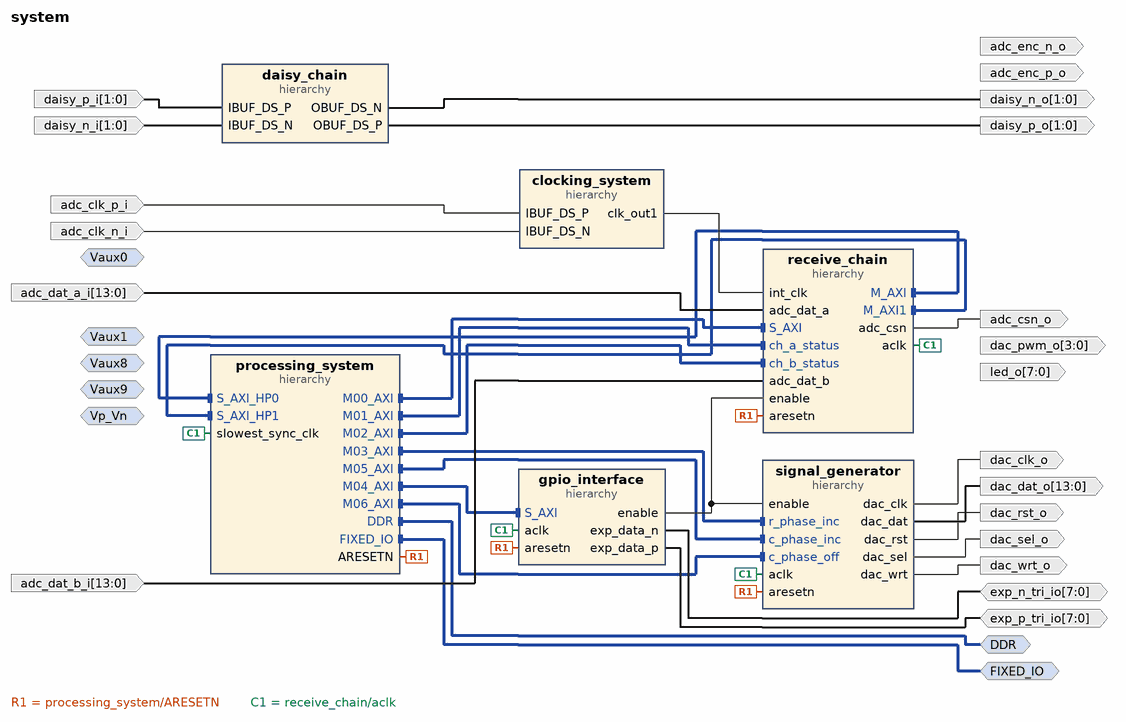
[diagram p0: block diagram of the top level]
# Vivado block design system, Vivado 2016.2
create_bd_design system

create_bd_intf_port -mode Master -vlnv xilinx.com:interface:ddrx_rtl:1.0 DDR
create_bd_intf_port -mode Master -vlnv xilinx.com:display_processing_system7:fixedio_rtl:1.0 FIXED_IO
create_bd_intf_port -mode Slave -vlnv xilinx.com:interface:diff_analog_io_rtl:1.0 Vp_Vn
create_bd_intf_port -mode Slave -vlnv xilinx.com:interface:diff_analog_io_rtl:1.0 Vaux0
create_bd_intf_port -mode Slave -vlnv xilinx.com:interface:diff_analog_io_rtl:1.0 Vaux1
create_bd_intf_port -mode Slave -vlnv xilinx.com:interface:diff_analog_io_rtl:1.0 Vaux9
create_bd_intf_port -mode Slave -vlnv xilinx.com:interface:diff_analog_io_rtl:1.0 Vaux8
create_bd_port -dir O adc_enc_p_o
create_bd_port -dir O adc_enc_n_o
create_bd_port -dir O -from 3 -to 0 dac_pwm_o
create_bd_port -dir O -from 7 -to 0 led_o
create_bd_port -dir I -from 13 -to 0 adc_dat_a_i
create_bd_port -dir I -from 13 -to 0 adc_dat_b_i
create_bd_port -dir O adc_csn_o
create_bd_port -dir O -from 1 -to 0 daisy_n_o
create_bd_port -dir O -from 1 -to 0 daisy_p_o
create_bd_port -dir I -from 1 -to 0 daisy_p_i
create_bd_port -dir I -from 1 -to 0 daisy_n_i
create_bd_port -dir I adc_clk_p_i
create_bd_port -dir I adc_clk_n_i
create_bd_port -dir O dac_clk_o
create_bd_port -dir O dac_rst_o
create_bd_port -dir O dac_sel_o
create_bd_port -dir O dac_wrt_o
create_bd_port -dir O -from 13 -to 0 dac_dat_o
create_bd_port -dir IO -from 7 -to 0 exp_n_tri_io
create_bd_port -dir IO -from 7 -to 0 exp_p_tri_io

create_bd_cell -type hier daisy_chain
create_bd_cell -type hier clocking_system
create_bd_cell -type hier processing_system
create_bd_cell -type hier receive_chain
create_bd_cell -type hier signal_generator
create_bd_cell -type hier gpio_interface

# ---- hierarchy /daisy_chain ----
current_bd_instance /daisy_chain
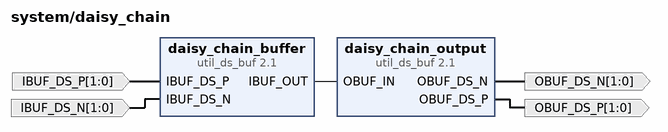
[diagram p1: block diagram inside /daisy_chain]
create_bd_pin -dir I -from 1 -to 0 IBUF_DS_P
create_bd_pin -dir I -from 1 -to 0 IBUF_DS_N
create_bd_pin -dir O -from 1 -to 0 OBUF_DS_P
create_bd_pin -dir O -from 1 -to 0 OBUF_DS_N

create_bd_cell -type ip -vlnv xilinx.com:ip:util_ds_buf:2.1 daisy_chain_buffer
set_property -dict {CONFIG.C_SIZE 2} [get_bd_cells daisy_chain_buffer]
create_bd_cell -type ip -vlnv xilinx.com:ip:util_ds_buf:2.1 daisy_chain_output
set_property -dict {CONFIG.C_SIZE 2 CONFIG.C_BUF_TYPE OBUFDS} [get_bd_cells daisy_chain_output]

# ---- hierarchy /clocking_system ----
current_bd_instance /clocking_system
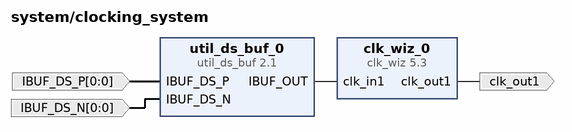
[diagram p2: block diagram inside /clocking_system]
create_bd_pin -dir I -from 0 -to 0 IBUF_DS_P
create_bd_pin -dir I -from 0 -to 0 IBUF_DS_N
create_bd_pin -dir O -type clk clk_out1

create_bd_cell -type ip -vlnv xilinx.com:ip:util_ds_buf:2.1 util_ds_buf_0
create_bd_cell -type ip -vlnv xilinx.com:ip:clk_wiz:5.3 clk_wiz_0
set_property -dict [list \
  CONFIG.PRIM_IN_FREQ 125 \
  CONFIG.CLKIN1_JITTER_PS 80.0 \
  CONFIG.CLKOUT1_REQUESTED_OUT_FREQ 125 \
  CONFIG.USE_LOCKED false \
  CONFIG.USE_RESET false \
  CONFIG.MMCM_DIVCLK_DIVIDE 1 \
  CONFIG.MMCM_CLKFBOUT_MULT_F 8.000 \
  CONFIG.MMCM_CLKIN1_PERIOD 8.0 \
  CONFIG.MMCM_CLKOUT0_DIVIDE_F 8.000 \
  CONFIG.CLKOUT1_JITTER 119.348 \
  CONFIG.CLKOUT1_PHASE_ERROR 96.948 \
] [get_bd_cells clk_wiz_0]

# ---- hierarchy /processing_system ----
current_bd_instance /processing_system
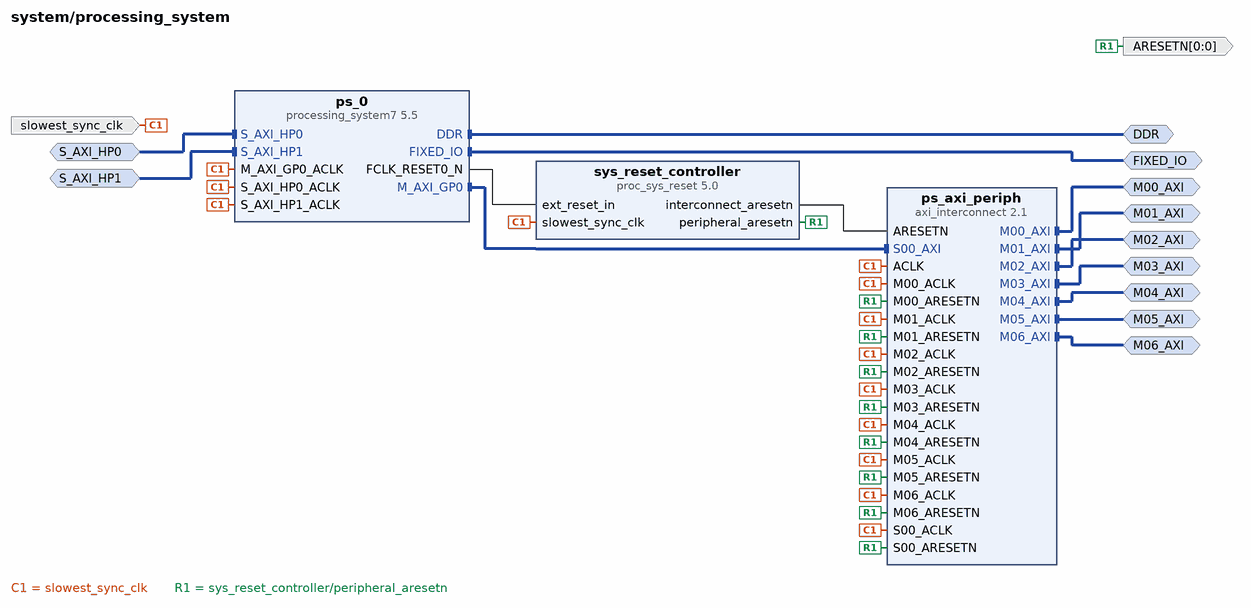
[diagram p3: block diagram inside /processing_system]
create_bd_intf_pin -mode Master -vlnv xilinx.com:interface:ddrx_rtl:1.0 DDR
create_bd_intf_pin -mode Master -vlnv xilinx.com:display_processing_system7:fixedio_rtl:1.0 FIXED_IO
create_bd_intf_pin -mode Slave -vlnv xilinx.com:interface:aximm_rtl:1.0 S_AXI_HP0
create_bd_intf_pin -mode Slave -vlnv xilinx.com:interface:aximm_rtl:1.0 S_AXI_HP1
create_bd_intf_pin -mode Master -vlnv xilinx.com:interface:aximm_rtl:1.0 M00_AXI
create_bd_intf_pin -mode Master -vlnv xilinx.com:interface:aximm_rtl:1.0 M01_AXI
create_bd_intf_pin -mode Master -vlnv xilinx.com:interface:aximm_rtl:1.0 M02_AXI
create_bd_intf_pin -mode Master -vlnv xilinx.com:interface:aximm_rtl:1.0 M03_AXI
create_bd_intf_pin -mode Master -vlnv xilinx.com:interface:aximm_rtl:1.0 M04_AXI
create_bd_intf_pin -mode Master -vlnv xilinx.com:interface:aximm_rtl:1.0 M05_AXI
create_bd_intf_pin -mode Master -vlnv xilinx.com:interface:aximm_rtl:1.0 M06_AXI
create_bd_pin -dir I -type clk slowest_sync_clk
create_bd_pin -dir O -from 0 -to 0 -type rst ARESETN

create_bd_cell -type ip -vlnv xilinx.com:ip:processing_system7:5.5 ps_0
set_property -dict [list \
  CONFIG.PCW_FPGA0_PERIPHERAL_FREQMHZ 155 \
  CONFIG.PCW_USE_S_AXI_HP0 1 \
  CONFIG.PCW_USE_S_AXI_HP1 1 \
  CONFIG.PCW_S_AXI_HP0_DATA_WIDTH 32 \
  CONFIG.PCW_S_AXI_HP1_DATA_WIDTH 32 \
  CONFIG.PCW_EN_CLK0_PORT 0 \
  CONFIG.PCW_IMPORT_BOARD_PRESET cfg/red_pitaya.xml \
  CONFIG.PCW_QSPI_GRP_SINGLE_SS_ENABLE 1 \
] [get_bd_cells ps_0]
# 3 more settings of ps_0 are not shown: defaults, MIO pin electricals, DDR timing, and values the tool derives
create_bd_cell -type ip -vlnv xilinx.com:ip:proc_sys_reset:5.0 sys_reset_controller
create_bd_cell -type ip -vlnv xilinx.com:ip:axi_interconnect:2.1 ps_axi_periph
set_property -dict {CONFIG.NUM_MI 7 CONFIG.ENABLE_ADVANCED_OPTIONS 0} [get_bd_cells ps_axi_periph]

# ---- hierarchy /receive_chain ----
current_bd_instance /receive_chain
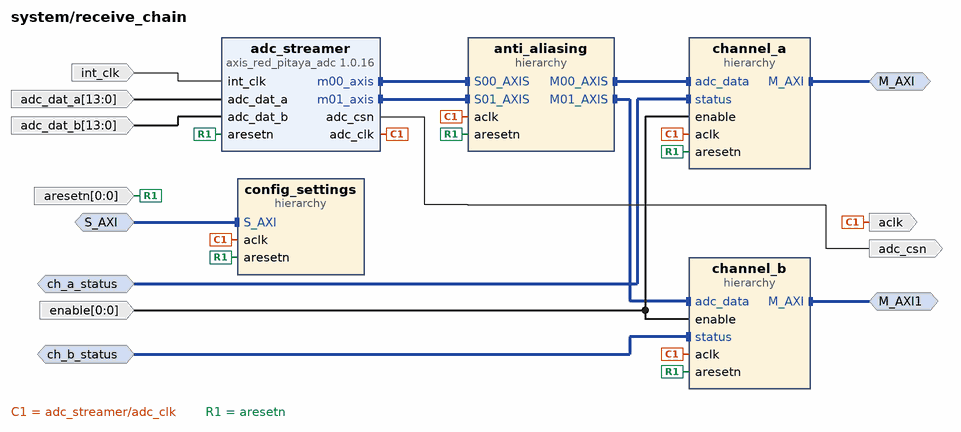
[diagram p4: block diagram inside /receive_chain]
create_bd_intf_pin -mode Slave -vlnv xilinx.com:interface:aximm_rtl:1.0 ch_a_status
create_bd_intf_pin -mode Master -vlnv xilinx.com:interface:aximm_rtl:1.0 M_AXI
create_bd_intf_pin -mode Master -vlnv xilinx.com:interface:aximm_rtl:1.0 M_AXI1
create_bd_intf_pin -mode Slave -vlnv xilinx.com:interface:aximm_rtl:1.0 ch_b_status
create_bd_intf_pin -mode Slave -vlnv xilinx.com:interface:aximm_rtl:1.0 S_AXI
create_bd_pin -dir O -type clk aclk
create_bd_pin -dir O adc_csn
create_bd_pin -dir I int_clk
create_bd_pin -dir I -from 13 -to 0 adc_dat_a
create_bd_pin -dir I -from 13 -to 0 adc_dat_b
create_bd_pin -dir I -from 0 -to 0 -type rst aresetn
create_bd_pin -dir I -from 0 -to 0 -type rst enable

create_bd_cell -type ip -vlnv pavel-demin:user:axis_red_pitaya_adc:1.0.16 adc_streamer
set_property -dict {CONFIG.AXIS_TDATA_WIDTH 16} [get_bd_cells adc_streamer]
create_bd_cell -type hier channel_a
create_bd_cell -type hier channel_b
create_bd_cell -type hier config_settings
create_bd_cell -type hier anti_aliasing

# ---- hierarchy /receive_chain/channel_a ----
current_bd_instance /receive_chain/channel_a
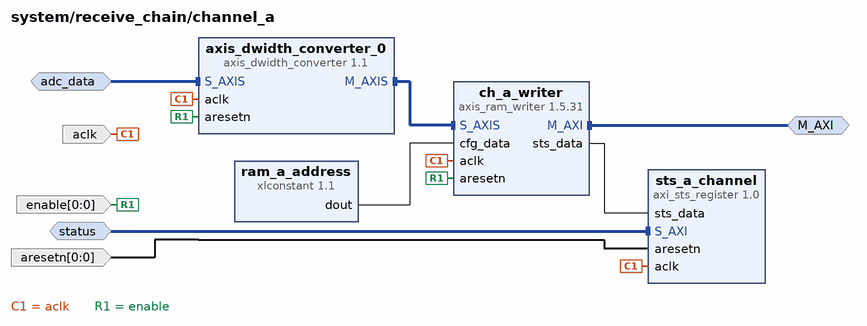
[diagram p5: block diagram inside /receive_chain/channel_a]
create_bd_intf_pin -mode Slave -vlnv xilinx.com:interface:aximm_rtl:1.0 status
create_bd_intf_pin -mode Master -vlnv xilinx.com:interface:aximm_rtl:1.0 M_AXI
create_bd_intf_pin -mode Slave -vlnv xilinx.com:interface:axis_rtl:1.0 adc_data
create_bd_pin -dir I -type clk aclk
create_bd_pin -dir I -from 0 -to 0 -type rst enable
create_bd_pin -dir I -from 0 -to 0 -type rst aresetn

create_bd_cell -type ip -vlnv xilinx.com:ip:axis_dwidth_converter:1.1 axis_dwidth_converter_0
set_property -dict {CONFIG.S_TDATA_NUM_BYTES 2 CONFIG.M_TDATA_NUM_BYTES 4} [get_bd_cells axis_dwidth_converter_0]
create_bd_cell -type ip -vlnv tighe-barris:user:axis_ram_writer:1.5.31 ch_a_writer
set_property -dict {CONFIG.AXI_DATA_WIDTH 32 CONFIG.AXIS_TDATA_WIDTH 32} [get_bd_cells ch_a_writer]
create_bd_cell -type ip -vlnv xilinx.com:ip:xlconstant:1.1 ram_a_address
set_property -dict {CONFIG.CONST_WIDTH 32 CONFIG.CONST_VAL 503316480} [get_bd_cells ram_a_address]
create_bd_cell -type ip -vlnv pavel-demin:user:axi_sts_register:1.0 sts_a_channel
set_property -dict {CONFIG.STS_DATA_WIDTH 32 CONFIG.AXI_DATA_WIDTH 32 CONFIG.AXI_ADDR_WIDTH 32} [get_bd_cells sts_a_channel]

# ---- hierarchy /receive_chain/channel_b ----
current_bd_instance /receive_chain/channel_b
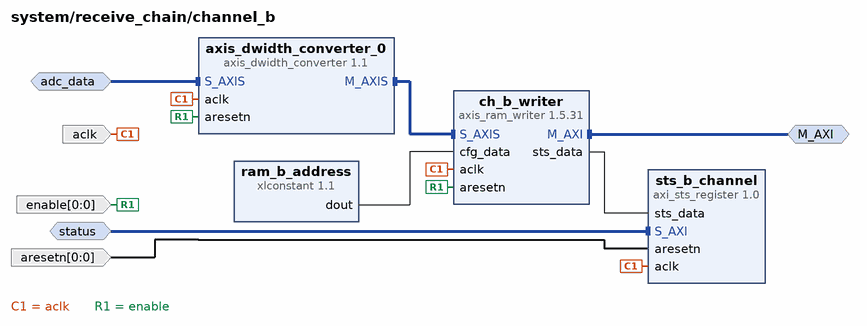
[diagram p6: block diagram inside /receive_chain/channel_b]
create_bd_intf_pin -mode Master -vlnv xilinx.com:interface:aximm_rtl:1.0 M_AXI
create_bd_intf_pin -mode Slave -vlnv xilinx.com:interface:aximm_rtl:1.0 status
create_bd_intf_pin -mode Slave -vlnv xilinx.com:interface:axis_rtl:1.0 adc_data
create_bd_pin -dir I -type clk aclk
create_bd_pin -dir I -from 0 -to 0 -type rst enable
create_bd_pin -dir I -from 0 -to 0 -type rst aresetn

create_bd_cell -type ip -vlnv xilinx.com:ip:axis_dwidth_converter:1.1 axis_dwidth_converter_0
set_property -dict {CONFIG.S_TDATA_NUM_BYTES 2 CONFIG.M_TDATA_NUM_BYTES 4} [get_bd_cells axis_dwidth_converter_0]
create_bd_cell -type ip -vlnv tighe-barris:user:axis_ram_writer:1.5.31 ch_b_writer
set_property -dict {CONFIG.AXI_DATA_WIDTH 32 CONFIG.AXIS_TDATA_WIDTH 32} [get_bd_cells ch_b_writer]
create_bd_cell -type ip -vlnv xilinx.com:ip:xlconstant:1.1 ram_b_address
set_property -dict {CONFIG.CONST_WIDTH 32 CONFIG.CONST_VAL 507510784} [get_bd_cells ram_b_address]
create_bd_cell -type ip -vlnv pavel-demin:user:axi_sts_register:1.0 sts_b_channel
set_property -dict {CONFIG.STS_DATA_WIDTH 32 CONFIG.AXI_DATA_WIDTH 32 CONFIG.AXI_ADDR_WIDTH 32} [get_bd_cells sts_b_channel]

# ---- hierarchy /receive_chain/config_settings ----
current_bd_instance /receive_chain/config_settings
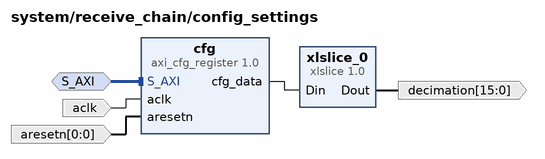
[diagram p7: block diagram inside /receive_chain/config_settings]
create_bd_intf_pin -mode Slave -vlnv xilinx.com:interface:aximm_rtl:1.0 S_AXI
create_bd_pin -dir O -from 15 -to 0 decimation
create_bd_pin -dir I -type clk aclk
create_bd_pin -dir I -from 0 -to 0 -type rst aresetn

create_bd_cell -type ip -vlnv xilinx.com:ip:xlslice:1.0 xlslice_0
set_property -dict {CONFIG.DOUT_WIDTH 16 CONFIG.DIN_TO 0 CONFIG.DIN_FROM 15} [get_bd_cells xlslice_0]
create_bd_cell -type ip -vlnv pavel-demin:user:axi_cfg_register:1.0 cfg
set_property -dict {CONFIG.CFG_DATA_WIDTH 32 CONFIG.AXI_DATA_WIDTH 32 CONFIG.AXI_ADDR_WIDTH 32} [get_bd_cells cfg]

# ---- hierarchy /receive_chain/anti_aliasing ----
current_bd_instance /receive_chain/anti_aliasing
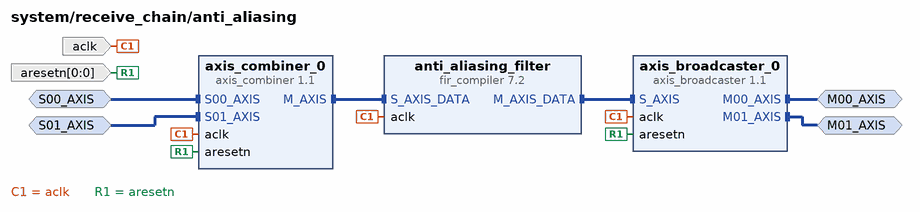
[diagram p8: block diagram inside /receive_chain/anti_aliasing]
create_bd_intf_pin -mode Slave -vlnv xilinx.com:interface:axis_rtl:1.0 S00_AXIS
create_bd_intf_pin -mode Slave -vlnv xilinx.com:interface:axis_rtl:1.0 S01_AXIS
create_bd_intf_pin -mode Master -vlnv xilinx.com:interface:axis_rtl:1.0 M00_AXIS
create_bd_intf_pin -mode Master -vlnv xilinx.com:interface:axis_rtl:1.0 M01_AXIS
create_bd_pin -dir I -type clk aclk
create_bd_pin -dir I -from 0 -to 0 -type rst aresetn

create_bd_cell -type ip -vlnv xilinx.com:ip:fir_compiler:7.2 anti_aliasing_filter
set_property -dict [list \
  CONFIG.CoefficientVector {0.000025654459771250994, 0.000074863433896161, 0.00014308597017204932, 0.00019205063416382977, 0.0001604266530866464, -0.000008361124011312541, -0.00032043167611177034, -0.0006926140921754971, -0.000952723258629777, -0.0008994245783101239, -0.0004099213080782916, 0.00045435909055407036, 0.001412980878301107, 0.0020510013567718688, 0.002010531508597773, 0.0012039571783876246, -0.00007720411271357928, -0.001254337513318309, -0.0017500056617930227, -0.0013406384683297494, -0.000364990726555941, 0.0003826285989469067, 0.00008693721353558415, -0.0015214223511449368, -0.003798614881415195, -0.00531121573513606, -0.004506260726651526, -0.0006549938308313636, 0.005439256657198806, 0.011455971684251895, 0.014456936577037123, 0.012339604921760181, 0.005119097924542997, -0.004725973426464719, -0.013202481140406187, -0.016715219789056705, -0.013998812495713744, -0.006966205975086943, 0.00016574983988531652, 0.0032006059922921235, 0.0005689297840865515, -0.0052985069269039795, -0.008860114692637512, -0.004478366117148616, 0.009848915330440116, 0.03011212731262171, 0.04692240258961073, 0.049390849984873475, 0.030726993425922545, -0.0071576310773233615, -0.052642137519117345, -0.08807787289178556, -0.09698989684947774, -0.07171979224533209, -0.01789182930481286, 0.046697650201782306, 0.09868128702828007, 0.11853265350570316, 0.09868128702828007, 0.046697650201782306, -0.01789182930481286, -0.07171979224533209, -0.09698989684947774, -0.08807787289178556, -0.052642137519117345, -0.0071576310773233615, 0.030726993425922545, 0.049390849984873475, 0.04692240258961073, 0.03011212731262171, 0.009848915330440116, -0.004478366117148616, -0.008860114692637512, -0.0052985069269039795, 0.0005689297840865515, 0.0032006059922921235, 0.00016574983988531652, -0.006966205975086943, -0.013998812495713744, -0.016715219789056705, -0.013202481140406187, -0.004725973426464719, 0.005119097924542997, 0.012339604921760181, 0.014456936577037123, 0.011455971684251895, 0.005439256657198806, -0.0006549938308313636, -0.004506260726651526, -0.00531121573513606, -0.003798614881415195, -0.0015214223511449368, 0.00008693721353558415, 0.0003826285989469067, -0.000364990726555941, -0.0013406384683297494, -0.0017500056617930227, -0.001254337513318309, -0.00007720411271357928, 0.0012039571783876246, 0.002010531508597773, 0.0020510013567718688, 0.001412980878301107, 0.00045435909055407036, -0.0004099213080782916, -0.0008994245783101239, -0.000952723258629777, -0.0006926140921754971, -0.00032043167611177034, -0.000008361124011312541, 0.0001604266530866464, 0.00019205063416382977, 0.00014308597017204932, 0.000074863433896161, 0.000025654459771250994} \
  CONFIG.Coefficient_Sets 1 \
  CONFIG.Filter_Type Decimation \
  CONFIG.Interpolation_Rate 1 \
  CONFIG.Decimation_Rate 8 \
  CONFIG.Zero_Pack_Factor 1 \
  CONFIG.Number_Channels 1 \
  CONFIG.Number_Paths 2 \
  CONFIG.RateSpecification Frequency_Specification \
  CONFIG.Sample_Frequency 125 \
  CONFIG.Clock_Frequency 125 \
  CONFIG.Coefficient_Sign Signed \
  CONFIG.Quantization Quantize_Only \
  CONFIG.Coefficient_Width 32 \
  CONFIG.Coefficient_Fractional_Bits 34 \
  CONFIG.Coefficient_Structure Inferred \
  CONFIG.Data_Width 14 \
  CONFIG.Output_Rounding_Mode Convergent_Rounding_to_Even \
  CONFIG.Output_Width 16 \
  CONFIG.Filter_Architecture Systolic_Multiply_Accumulate \
  CONFIG.ColumnConfig 8 \
] [get_bd_cells anti_aliasing_filter]
create_bd_cell -type ip -vlnv xilinx.com:ip:axis_combiner:1.1 axis_combiner_0
set_property -dict {CONFIG.TDATA_NUM_BYTES 2} [get_bd_cells axis_combiner_0]
create_bd_cell -type ip -vlnv xilinx.com:ip:axis_broadcaster:1.1 axis_broadcaster_0
set_property -dict [list \
  CONFIG.M_TDATA_NUM_BYTES 2 \
  CONFIG.S_TDATA_NUM_BYTES 4 \
  CONFIG.M00_TDATA_REMAP {tdata[15:0]} \
  CONFIG.M01_TDATA_REMAP {tdata[31:16]} \
] [get_bd_cells axis_broadcaster_0]

# ---- hierarchy /signal_generator ----
current_bd_instance /signal_generator
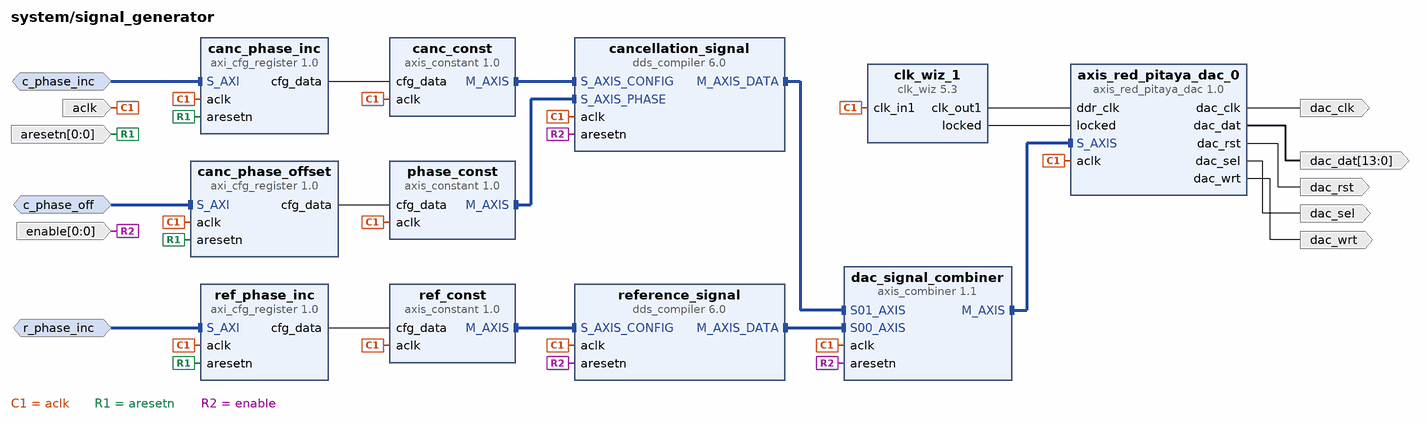
[diagram p9: block diagram inside /signal_generator]
create_bd_intf_pin -mode Slave -vlnv xilinx.com:interface:aximm_rtl:1.0 r_phase_inc
create_bd_intf_pin -mode Slave -vlnv xilinx.com:interface:aximm_rtl:1.0 c_phase_inc
create_bd_intf_pin -mode Slave -vlnv xilinx.com:interface:aximm_rtl:1.0 c_phase_off
create_bd_pin -dir I -type clk aclk
create_bd_pin -dir O -type clk dac_clk
create_bd_pin -dir O -type rst dac_rst
create_bd_pin -dir O dac_sel
create_bd_pin -dir O dac_wrt
create_bd_pin -dir O -from 13 -to 0 dac_dat
create_bd_pin -dir I -from 0 -to 0 -type rst aresetn
create_bd_pin -dir I -from 0 -to 0 -type rst enable

create_bd_cell -type ip -vlnv pavel-demin:user:axis_red_pitaya_dac:1.0 axis_red_pitaya_dac_0
create_bd_cell -type ip -vlnv xilinx.com:ip:clk_wiz:5.3 clk_wiz_1
set_property -dict [list \
  CONFIG.PRIM_IN_FREQ 125 \
  CONFIG.CLKIN1_JITTER_PS 80.0 \
  CONFIG.CLKOUT1_REQUESTED_OUT_FREQ 250 \
  CONFIG.USE_RESET false \
  CONFIG.MMCM_DIVCLK_DIVIDE 1 \
  CONFIG.MMCM_CLKFBOUT_MULT_F 8.000 \
  CONFIG.MMCM_CLKIN1_PERIOD 8.0 \
  CONFIG.MMCM_CLKOUT0_DIVIDE_F 4.000 \
  CONFIG.CLKOUT1_JITTER 104.759 \
  CONFIG.CLKOUT1_PHASE_ERROR 96.948 \
] [get_bd_cells clk_wiz_1]
create_bd_cell -type ip -vlnv xilinx.com:ip:dds_compiler:6.0 reference_signal
set_property -dict [list \
  CONFIG.DDS_Clock_Rate 125 \
  CONFIG.Parameter_Entry Hardware_Parameters \
  CONFIG.Frequency_Resolution 0.4 \
  CONFIG.Noise_Shaping None \
  CONFIG.Phase_Width 32 \
  CONFIG.Output_Width 13 \
  CONFIG.Phase_Increment Programmable \
  CONFIG.Output_Selection Sine \
  CONFIG.Amplitude_Mode Full_Range \
  CONFIG.Has_Phase_Out false \
  CONFIG.DATA_Has_TLAST Not_Required \
  CONFIG.S_PHASE_Has_TUSER Not_Required \
  CONFIG.M_DATA_Has_TUSER Not_Required \
  CONFIG.Latency 7 \
  CONFIG.Has_ARESETn true \
  CONFIG.Output_Frequency1 0 \
  CONFIG.PINC1 10000011000100100110111 \
] [get_bd_cells reference_signal]
create_bd_cell -type ip -vlnv pavel-demin:user:axi_cfg_register:1.0 ref_phase_inc
set_property -dict {CONFIG.CFG_DATA_WIDTH 32 CONFIG.AXI_DATA_WIDTH 32} [get_bd_cells ref_phase_inc]
create_bd_cell -type ip -vlnv pavel-demin:user:axis_constant:1.0 ref_const
set_property -dict {CONFIG.AXIS_TDATA_WIDTH 32} [get_bd_cells ref_const]
create_bd_cell -type ip -vlnv pavel-demin:user:axi_cfg_register:1.0 canc_phase_inc
set_property -dict {CONFIG.CFG_DATA_WIDTH 32} [get_bd_cells canc_phase_inc]
create_bd_cell -type ip -vlnv pavel-demin:user:axis_constant:1.0 canc_const
create_bd_cell -type ip -vlnv xilinx.com:ip:dds_compiler:6.0 cancellation_signal
set_property -dict [list \
  CONFIG.DDS_Clock_Rate 125 \
  CONFIG.Parameter_Entry Hardware_Parameters \
  CONFIG.Frequency_Resolution 0.4 \
  CONFIG.Noise_Shaping None \
  CONFIG.Phase_Width 32 \
  CONFIG.Output_Width 13 \
  CONFIG.Phase_Increment Programmable \
  CONFIG.Phase_offset Streaming \
  CONFIG.Output_Selection Sine \
  CONFIG.Amplitude_Mode Full_Range \
  CONFIG.Has_Phase_Out false \
  CONFIG.DATA_Has_TLAST Not_Required \
  CONFIG.S_PHASE_Has_TUSER Not_Required \
  CONFIG.M_DATA_Has_TUSER Not_Required \
  CONFIG.Latency 8 \
  CONFIG.Has_ARESETn true \
  CONFIG.Output_Frequency1 0 \
  CONFIG.PINC1 10000011000100100110111 \
] [get_bd_cells cancellation_signal]
create_bd_cell -type ip -vlnv xilinx.com:ip:axis_combiner:1.1 dac_signal_combiner
create_bd_cell -type ip -vlnv pavel-demin:user:axis_constant:1.0 phase_const
create_bd_cell -type ip -vlnv pavel-demin:user:axi_cfg_register:1.0 canc_phase_offset
set_property -dict {CONFIG.CFG_DATA_WIDTH 32} [get_bd_cells canc_phase_offset]

# ---- hierarchy /gpio_interface ----
current_bd_instance /gpio_interface
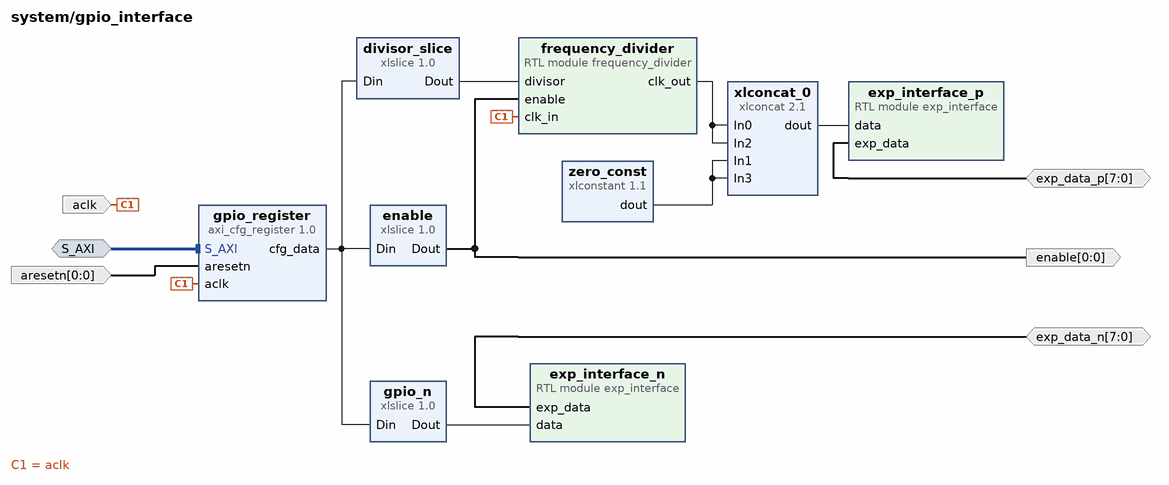
[diagram p10: block diagram inside /gpio_interface]
create_bd_intf_pin -mode Slave -vlnv xilinx.com:interface:aximm_rtl:1.0 S_AXI
create_bd_pin -dir I -type clk aclk
create_bd_pin -dir I -from 0 -to 0 -type rst aresetn
create_bd_pin -dir IO -from 7 -to 0 exp_data_n
create_bd_pin -dir IO -from 7 -to 0 exp_data_p
create_bd_pin -dir O -from 0 -to 0 enable

create_bd_cell -type ip -vlnv pavel-demin:user:axi_cfg_register:1.0 gpio_register
set_property -dict {CONFIG.CFG_DATA_WIDTH 32} [get_bd_cells gpio_register]
create_bd_cell -type ip -vlnv xilinx.com:ip:xlslice:1.0 enable
set_property -dict {CONFIG.DOUT_WIDTH 1 CONFIG.DIN_TO 8 CONFIG.DIN_FROM 8} [get_bd_cells enable]
create_bd_cell -type ip -vlnv xilinx.com:ip:xlslice:1.0 gpio_n
set_property -dict {CONFIG.DOUT_WIDTH 8 CONFIG.DIN_TO 0 CONFIG.DIN_FROM 7} [get_bd_cells gpio_n]
create_bd_cell -type ip -vlnv xilinx.com:ip:xlconcat:2.1 xlconcat_0
set_property -dict [list \
  CONFIG.NUM_PORTS 4 \
  CONFIG.IN0_WIDTH 1 \
  CONFIG.IN1_WIDTH 3 \
  CONFIG.IN2_WIDTH 1 \
  CONFIG.IN3_WIDTH 3 \
] [get_bd_cells xlconcat_0]
create_bd_cell -type module -reference exp_interface exp_interface_n
create_bd_cell -type ip -vlnv xilinx.com:ip:xlslice:1.0 divisor_slice
set_property -dict {CONFIG.DOUT_WIDTH 23 CONFIG.DIN_TO 9 CONFIG.DIN_FROM 31} [get_bd_cells divisor_slice]
create_bd_cell -type ip -vlnv xilinx.com:ip:xlconstant:1.1 zero_const
set_property -dict {CONFIG.CONST_WIDTH 3 CONFIG.CONST_VAL 0} [get_bd_cells zero_const]
create_bd_cell -type module -reference frequency_divider frequency_divider
create_bd_cell -type module -reference exp_interface exp_interface_p

# ---- connections ----

current_bd_instance /daisy_chain
connect_bd_net [get_bd_pins daisy_chain_buffer/IBUF_OUT] [get_bd_pins daisy_chain_output/OBUF_IN]
connect_bd_net -net daisy_p_i_1 [get_bd_pins IBUF_DS_P] [get_bd_pins daisy_chain_buffer/IBUF_DS_P]
connect_bd_net -net daisy_n_i_1 [get_bd_pins IBUF_DS_N] [get_bd_pins daisy_chain_buffer/IBUF_DS_N]
connect_bd_net -net util_ds_buf_2_OBUF_DS_P [get_bd_pins daisy_chain_output/OBUF_DS_P] [get_bd_pins OBUF_DS_P]
connect_bd_net -net util_ds_buf_2_OBUF_DS_N [get_bd_pins daisy_chain_output/OBUF_DS_N] [get_bd_pins OBUF_DS_N]

current_bd_instance /clocking_system
connect_bd_net [get_bd_pins util_ds_buf_0/IBUF_OUT] [get_bd_pins clk_wiz_0/clk_in1]
connect_bd_net -net adc_clk_p_i_1 [get_bd_pins IBUF_DS_P] [get_bd_pins util_ds_buf_0/IBUF_DS_P]
connect_bd_net -net adc_clk_n_i_1 [get_bd_pins IBUF_DS_N] [get_bd_pins util_ds_buf_0/IBUF_DS_N]
connect_bd_net [get_bd_pins clk_wiz_0/clk_out1] [get_bd_pins clk_out1]

current_bd_instance /processing_system
connect_bd_intf_net [get_bd_intf_pins ps_0/M_AXI_GP0] [get_bd_intf_pins ps_axi_periph/S00_AXI]
connect_bd_intf_net [get_bd_intf_pins DDR] [get_bd_intf_pins ps_0/DDR]
connect_bd_intf_net [get_bd_intf_pins FIXED_IO] [get_bd_intf_pins ps_0/FIXED_IO]
connect_bd_intf_net -intf_net axis_ram_writer_0_M_AXI [get_bd_intf_pins S_AXI_HP0] [get_bd_intf_pins ps_0/S_AXI_HP0]
connect_bd_intf_net -intf_net channel_b_M_AXI [get_bd_intf_pins S_AXI_HP1] [get_bd_intf_pins ps_0/S_AXI_HP1]
connect_bd_intf_net [get_bd_intf_pins M00_AXI] [get_bd_intf_pins ps_axi_periph/M00_AXI]
connect_bd_intf_net [get_bd_intf_pins M01_AXI] [get_bd_intf_pins ps_axi_periph/M01_AXI]
connect_bd_intf_net -intf_net S_AXI_1 [get_bd_intf_pins M02_AXI] [get_bd_intf_pins ps_axi_periph/M02_AXI]
connect_bd_intf_net [get_bd_intf_pins M03_AXI] [get_bd_intf_pins ps_axi_periph/M03_AXI]
connect_bd_intf_net [get_bd_intf_pins M04_AXI] [get_bd_intf_pins ps_axi_periph/M04_AXI]
connect_bd_intf_net [get_bd_intf_pins M05_AXI] [get_bd_intf_pins ps_axi_periph/M05_AXI]
connect_bd_intf_net [get_bd_intf_pins M06_AXI] [get_bd_intf_pins ps_axi_periph/M06_AXI]
connect_bd_net [get_bd_pins ps_0/FCLK_RESET0_N] [get_bd_pins sys_reset_controller/ext_reset_in]
connect_bd_net -net rst_0_interconnect_aresetn [get_bd_pins sys_reset_controller/interconnect_aresetn] [get_bd_pins ps_axi_periph/ARESETN]
connect_bd_net -net clk_sync_clk_out1 [get_bd_pins slowest_sync_clk] \
  [get_bd_pins sys_reset_controller/slowest_sync_clk] [get_bd_pins ps_0/S_AXI_HP0_ACLK] [get_bd_pins ps_0/S_AXI_HP1_ACLK] \
  [get_bd_pins ps_0/M_AXI_GP0_ACLK] [get_bd_pins ps_axi_periph/ACLK] [get_bd_pins ps_axi_periph/S00_ACLK] \
  [get_bd_pins ps_axi_periph/M00_ACLK] [get_bd_pins ps_axi_periph/M01_ACLK] [get_bd_pins ps_axi_periph/M02_ACLK] \
  [get_bd_pins ps_axi_periph/M03_ACLK] [get_bd_pins ps_axi_periph/M04_ACLK] [get_bd_pins ps_axi_periph/M05_ACLK] \
  [get_bd_pins ps_axi_periph/M06_ACLK]
connect_bd_net -net xlconstant_0_dout [get_bd_pins sys_reset_controller/peripheral_aresetn] \
  [get_bd_pins ARESETN] [get_bd_pins ps_axi_periph/S00_ARESETN] [get_bd_pins ps_axi_periph/M00_ARESETN] \
  [get_bd_pins ps_axi_periph/M01_ARESETN] [get_bd_pins ps_axi_periph/M02_ARESETN] [get_bd_pins ps_axi_periph/M03_ARESETN] \
  [get_bd_pins ps_axi_periph/M04_ARESETN] [get_bd_pins ps_axi_periph/M05_ARESETN] [get_bd_pins ps_axi_periph/M06_ARESETN]

current_bd_instance /receive_chain
connect_bd_intf_net [get_bd_intf_pins adc_streamer/m00_axis] [get_bd_intf_pins anti_aliasing/S00_AXIS]
connect_bd_intf_net [get_bd_intf_pins adc_streamer/m01_axis] [get_bd_intf_pins anti_aliasing/S01_AXIS]
connect_bd_intf_net -intf_net axis_broadcaster_0_M00_AXIS [get_bd_intf_pins anti_aliasing/M00_AXIS] [get_bd_intf_pins channel_a/adc_data]
connect_bd_intf_net -intf_net axis_broadcaster_0_M01_AXIS [get_bd_intf_pins anti_aliasing/M01_AXIS] [get_bd_intf_pins channel_b/adc_data]
connect_bd_intf_net [get_bd_intf_pins ch_a_status] [get_bd_intf_pins channel_a/status]
connect_bd_intf_net -intf_net axis_ram_writer_0_M_AXI [get_bd_intf_pins M_AXI] [get_bd_intf_pins channel_a/M_AXI]
connect_bd_intf_net [get_bd_intf_pins M_AXI1] [get_bd_intf_pins channel_b/M_AXI]
connect_bd_intf_net -intf_net S_AXI_1 [get_bd_intf_pins ch_b_status] [get_bd_intf_pins channel_b/status]
connect_bd_intf_net [get_bd_intf_pins S_AXI] [get_bd_intf_pins config_settings/S_AXI]
connect_bd_net -net clk_sync_clk_out1 [get_bd_pins adc_streamer/adc_clk] \
  [get_bd_pins aclk] [get_bd_pins channel_b/aclk] [get_bd_pins config_settings/aclk] [get_bd_pins channel_a/aclk] \
  [get_bd_pins anti_aliasing/aclk]
connect_bd_net -net axis_red_pitaya_adc_0_adc_csn [get_bd_pins adc_streamer/adc_csn] [get_bd_pins adc_csn]
connect_bd_net -net clk_wiz_0_clk_out1 [get_bd_pins int_clk] [get_bd_pins adc_streamer/int_clk]
connect_bd_net -net adc_dat_a_i_1 [get_bd_pins adc_dat_a] [get_bd_pins adc_streamer/adc_dat_a]
connect_bd_net -net adc_dat_b_i_1 [get_bd_pins adc_dat_b] [get_bd_pins adc_streamer/adc_dat_b]
connect_bd_net -net aresetn2_1 [get_bd_pins aresetn] \
  [get_bd_pins adc_streamer/aresetn] [get_bd_pins channel_b/aresetn] [get_bd_pins channel_a/aresetn] \
  [get_bd_pins config_settings/aresetn] [get_bd_pins anti_aliasing/aresetn]
connect_bd_net [get_bd_pins enable] [get_bd_pins channel_b/enable] [get_bd_pins channel_a/enable]

current_bd_instance /receive_chain/channel_a
connect_bd_intf_net [get_bd_intf_pins axis_dwidth_converter_0/M_AXIS] [get_bd_intf_pins ch_a_writer/S_AXIS]
connect_bd_intf_net [get_bd_intf_pins status] [get_bd_intf_pins sts_a_channel/S_AXI]
connect_bd_intf_net -intf_net axis_ram_writer_0_M_AXI [get_bd_intf_pins M_AXI] [get_bd_intf_pins ch_a_writer/M_AXI]
connect_bd_intf_net [get_bd_intf_pins adc_data] [get_bd_intf_pins axis_dwidth_converter_0/S_AXIS]
connect_bd_net [get_bd_pins ram_a_address/dout] [get_bd_pins ch_a_writer/cfg_data]
connect_bd_net [get_bd_pins ch_a_writer/sts_data] [get_bd_pins sts_a_channel/sts_data]
connect_bd_net -net clk_sync_clk_out1 [get_bd_pins aclk] \
  [get_bd_pins ch_a_writer/aclk] [get_bd_pins axis_dwidth_converter_0/aclk] [get_bd_pins sts_a_channel/aclk]
connect_bd_net -net aresetn_1 [get_bd_pins enable] [get_bd_pins axis_dwidth_converter_0/aresetn] [get_bd_pins ch_a_writer/aresetn]
connect_bd_net -net aresetn1_1 [get_bd_pins aresetn] [get_bd_pins sts_a_channel/aresetn]

current_bd_instance /receive_chain/channel_b
connect_bd_intf_net [get_bd_intf_pins axis_dwidth_converter_0/M_AXIS] [get_bd_intf_pins ch_b_writer/S_AXIS]
connect_bd_intf_net -intf_net axis_ram_writer_0_M_AXI [get_bd_intf_pins M_AXI] [get_bd_intf_pins ch_b_writer/M_AXI]
connect_bd_intf_net [get_bd_intf_pins status] [get_bd_intf_pins sts_b_channel/S_AXI]
connect_bd_intf_net [get_bd_intf_pins adc_data] [get_bd_intf_pins axis_dwidth_converter_0/S_AXIS]
connect_bd_net -net clk_sync_clk_out1 [get_bd_pins aclk] \
  [get_bd_pins ch_b_writer/aclk] [get_bd_pins axis_dwidth_converter_0/aclk] [get_bd_pins sts_b_channel/aclk]
connect_bd_net -net ram_a_address_dout [get_bd_pins ram_b_address/dout] [get_bd_pins ch_b_writer/cfg_data]
connect_bd_net -net ch_a_writer_sts_data [get_bd_pins ch_b_writer/sts_data] [get_bd_pins sts_b_channel/sts_data]
connect_bd_net -net aresetn_1 [get_bd_pins enable] [get_bd_pins axis_dwidth_converter_0/aresetn] [get_bd_pins ch_b_writer/aresetn]
connect_bd_net -net aresetn2_1 [get_bd_pins aresetn] [get_bd_pins sts_b_channel/aresetn]

current_bd_instance /receive_chain/config_settings
connect_bd_intf_net [get_bd_intf_pins S_AXI] [get_bd_intf_pins cfg/S_AXI]
connect_bd_net -net cfg_0_cfg_data [get_bd_pins cfg/cfg_data] [get_bd_pins xlslice_0/Din]
connect_bd_net [get_bd_pins xlslice_0/Dout] [get_bd_pins decimation]
connect_bd_net -net clk_sync_clk_out1 [get_bd_pins aclk] [get_bd_pins cfg/aclk]
connect_bd_net -net xlconstant_0_dout [get_bd_pins aresetn] [get_bd_pins cfg/aresetn]

current_bd_instance /receive_chain/anti_aliasing
connect_bd_intf_net [get_bd_intf_pins axis_combiner_0/M_AXIS] [get_bd_intf_pins anti_aliasing_filter/S_AXIS_DATA]
connect_bd_intf_net [get_bd_intf_pins anti_aliasing_filter/M_AXIS_DATA] [get_bd_intf_pins axis_broadcaster_0/S_AXIS]
connect_bd_intf_net -intf_net adc_streamer_m00_axis [get_bd_intf_pins S00_AXIS] [get_bd_intf_pins axis_combiner_0/S00_AXIS]
connect_bd_intf_net -intf_net adc_streamer_m01_axis [get_bd_intf_pins S01_AXIS] [get_bd_intf_pins axis_combiner_0/S01_AXIS]
connect_bd_intf_net [get_bd_intf_pins M00_AXIS] [get_bd_intf_pins axis_broadcaster_0/M00_AXIS]
connect_bd_intf_net [get_bd_intf_pins M01_AXIS] [get_bd_intf_pins axis_broadcaster_0/M01_AXIS]
connect_bd_net -net clk_sync_clk_out1 [get_bd_pins aclk] \
  [get_bd_pins axis_combiner_0/aclk] [get_bd_pins axis_broadcaster_0/aclk] [get_bd_pins anti_aliasing_filter/aclk]
connect_bd_net -net aresetn2_1 [get_bd_pins aresetn] [get_bd_pins axis_broadcaster_0/aresetn] [get_bd_pins axis_combiner_0/aresetn]

current_bd_instance /signal_generator
connect_bd_intf_net -intf_net axis_constant_0_M_AXIS [get_bd_intf_pins ref_const/M_AXIS] [get_bd_intf_pins reference_signal/S_AXIS_CONFIG]
connect_bd_intf_net [get_bd_intf_pins cancellation_signal/S_AXIS_CONFIG] [get_bd_intf_pins canc_const/M_AXIS]
connect_bd_intf_net -intf_net axis_constant_0_M_AXIS1 [get_bd_intf_pins phase_const/M_AXIS] [get_bd_intf_pins cancellation_signal/S_AXIS_PHASE]
connect_bd_intf_net [get_bd_intf_pins reference_signal/M_AXIS_DATA] [get_bd_intf_pins dac_signal_combiner/S00_AXIS]
connect_bd_intf_net [get_bd_intf_pins dac_signal_combiner/M_AXIS] [get_bd_intf_pins axis_red_pitaya_dac_0/S_AXIS]
connect_bd_intf_net [get_bd_intf_pins cancellation_signal/M_AXIS_DATA] [get_bd_intf_pins dac_signal_combiner/S01_AXIS]
connect_bd_intf_net [get_bd_intf_pins r_phase_inc] [get_bd_intf_pins ref_phase_inc/S_AXI]
connect_bd_intf_net -intf_net S_AXI1_1 [get_bd_intf_pins c_phase_inc] [get_bd_intf_pins canc_phase_inc/S_AXI]
connect_bd_intf_net [get_bd_intf_pins c_phase_off] [get_bd_intf_pins canc_phase_offset/S_AXI]
connect_bd_net [get_bd_pins clk_wiz_1/clk_out1] [get_bd_pins axis_red_pitaya_dac_0/ddr_clk]
connect_bd_net [get_bd_pins clk_wiz_1/locked] [get_bd_pins axis_red_pitaya_dac_0/locked]
connect_bd_net -net clk_sync_clk_out1 [get_bd_pins aclk] \
  [get_bd_pins reference_signal/aclk] [get_bd_pins clk_wiz_1/clk_in1] [get_bd_pins axis_red_pitaya_dac_0/aclk] \
  [get_bd_pins ref_phase_inc/aclk] [get_bd_pins ref_const/aclk] [get_bd_pins canc_phase_inc/aclk] \
  [get_bd_pins canc_const/aclk] [get_bd_pins cancellation_signal/aclk] [get_bd_pins dac_signal_combiner/aclk] \
  [get_bd_pins phase_const/aclk] [get_bd_pins canc_phase_offset/aclk]
connect_bd_net [get_bd_pins axis_red_pitaya_dac_0/dac_clk] [get_bd_pins dac_clk]
connect_bd_net [get_bd_pins axis_red_pitaya_dac_0/dac_rst] [get_bd_pins dac_rst]
connect_bd_net [get_bd_pins axis_red_pitaya_dac_0/dac_sel] [get_bd_pins dac_sel]
connect_bd_net [get_bd_pins axis_red_pitaya_dac_0/dac_wrt] [get_bd_pins dac_wrt]
connect_bd_net [get_bd_pins axis_red_pitaya_dac_0/dac_dat] [get_bd_pins dac_dat]
connect_bd_net [get_bd_pins aresetn] [get_bd_pins ref_phase_inc/aresetn] [get_bd_pins canc_phase_inc/aresetn] [get_bd_pins canc_phase_offset/aresetn]
connect_bd_net -net aresetn1_1 [get_bd_pins enable] \
  [get_bd_pins reference_signal/aresetn] [get_bd_pins cancellation_signal/aresetn] [get_bd_pins dac_signal_combiner/aresetn]
connect_bd_net -net sig_gen_config_cfg_data [get_bd_pins ref_phase_inc/cfg_data] [get_bd_pins ref_const/cfg_data]
connect_bd_net -net canc_cfg_cfg_data [get_bd_pins canc_phase_inc/cfg_data] [get_bd_pins canc_const/cfg_data]
connect_bd_net -net axi_cfg_register_0_cfg_data [get_bd_pins canc_phase_offset/cfg_data] [get_bd_pins phase_const/cfg_data]

current_bd_instance /gpio_interface
connect_bd_intf_net -intf_net processing_system_M04_AXI [get_bd_intf_pins S_AXI] [get_bd_intf_pins gpio_register/S_AXI]
connect_bd_net -net axi_cfg_register_0_cfg_data [get_bd_pins gpio_register/cfg_data] \
  [get_bd_pins enable/Din] [get_bd_pins gpio_n/Din] [get_bd_pins divisor_slice/Din]
connect_bd_net -net clk_sync_clk_out1 [get_bd_pins aclk] [get_bd_pins gpio_register/aclk] [get_bd_pins frequency_divider/clk_in]
connect_bd_net -net xlconstant_0_dout [get_bd_pins aresetn] [get_bd_pins gpio_register/aresetn]
connect_bd_net [get_bd_pins exp_data_n] [get_bd_pins exp_interface_n/exp_data]
connect_bd_net [get_bd_pins exp_data_p] [get_bd_pins exp_interface_p/exp_data]
connect_bd_net -net enable_prf_Dout [get_bd_pins enable/Dout] [get_bd_pins enable] [get_bd_pins frequency_divider/enable]
connect_bd_net -net gpio_n_upper_Dout [get_bd_pins gpio_n/Dout] [get_bd_pins exp_interface_n/data]
connect_bd_net -net trigger_1 [get_bd_pins frequency_divider/clk_out] [get_bd_pins xlconcat_0/In0] [get_bd_pins xlconcat_0/In2]
connect_bd_net [get_bd_pins xlconcat_0/dout] [get_bd_pins exp_interface_p/data]
connect_bd_net -net xlslice_0_Dout [get_bd_pins divisor_slice/Dout] [get_bd_pins frequency_divider/divisor]
connect_bd_net -net xlconstant_0_dout1 [get_bd_pins zero_const/dout] [get_bd_pins xlconcat_0/In1] [get_bd_pins xlconcat_0/In3]

current_bd_instance /
connect_bd_intf_net -intf_net axis_ram_writer_0_M_AXI [get_bd_intf_pins receive_chain/M_AXI] [get_bd_intf_pins processing_system/S_AXI_HP0]
connect_bd_intf_net [get_bd_intf_pins receive_chain/S_AXI] [get_bd_intf_pins processing_system/M00_AXI]
connect_bd_intf_net [get_bd_intf_pins processing_system/M01_AXI] [get_bd_intf_pins receive_chain/ch_a_status]
connect_bd_intf_net -intf_net S_AXI_1 [get_bd_intf_pins receive_chain/ch_b_status] [get_bd_intf_pins processing_system/M02_AXI]
connect_bd_intf_net -intf_net channel_b_M_AXI [get_bd_intf_pins receive_chain/M_AXI1] [get_bd_intf_pins processing_system/S_AXI_HP1]
connect_bd_intf_net [get_bd_intf_pins processing_system/M03_AXI] [get_bd_intf_pins signal_generator/r_phase_inc]
connect_bd_intf_net [get_bd_intf_pins gpio_interface/S_AXI] [get_bd_intf_pins processing_system/M04_AXI]
connect_bd_intf_net [get_bd_intf_pins processing_system/M05_AXI] [get_bd_intf_pins signal_generator/c_phase_inc]
connect_bd_intf_net -intf_net S_AXI2_1 [get_bd_intf_pins signal_generator/c_phase_off] [get_bd_intf_pins processing_system/M06_AXI]
connect_bd_intf_net -intf_net ps_0_DDR [get_bd_intf_ports DDR] [get_bd_intf_pins processing_system/DDR]
connect_bd_intf_net -intf_net ps_0_FIXED_IO [get_bd_intf_ports FIXED_IO] [get_bd_intf_pins processing_system/FIXED_IO]
connect_bd_net [get_bd_ports adc_dat_a_i] [get_bd_pins receive_chain/adc_dat_a]
connect_bd_net [get_bd_ports adc_dat_b_i] [get_bd_pins receive_chain/adc_dat_b]
connect_bd_net -net axis_red_pitaya_adc_0_adc_csn [get_bd_pins receive_chain/adc_csn] [get_bd_ports adc_csn_o]
connect_bd_net -net xlconstant_0_dout [get_bd_pins processing_system/ARESETN] \
  [get_bd_pins signal_generator/aresetn] [get_bd_pins receive_chain/aresetn] [get_bd_pins gpio_interface/aresetn]
connect_bd_net -net util_ds_buf_2_OBUF_DS_N [get_bd_pins daisy_chain/OBUF_DS_N] [get_bd_ports daisy_n_o]
connect_bd_net -net util_ds_buf_2_OBUF_DS_P [get_bd_pins daisy_chain/OBUF_DS_P] [get_bd_ports daisy_p_o]
connect_bd_net [get_bd_ports daisy_p_i] [get_bd_pins daisy_chain/IBUF_DS_P]
connect_bd_net [get_bd_ports daisy_n_i] [get_bd_pins daisy_chain/IBUF_DS_N]
connect_bd_net -net clk_sync_clk_out1 [get_bd_pins receive_chain/aclk] \
  [get_bd_pins processing_system/slowest_sync_clk] [get_bd_pins signal_generator/aclk] [get_bd_pins gpio_interface/aclk]
connect_bd_net [get_bd_ports adc_clk_p_i] [get_bd_pins clocking_system/IBUF_DS_P]
connect_bd_net [get_bd_ports adc_clk_n_i] [get_bd_pins clocking_system/IBUF_DS_N]
connect_bd_net -net clk_wiz_0_clk_out1 [get_bd_pins clocking_system/clk_out1] [get_bd_pins receive_chain/int_clk]
connect_bd_net -net axis_red_pitaya_dac_0_dac_clk [get_bd_pins signal_generator/dac_clk] [get_bd_ports dac_clk_o]
connect_bd_net -net axis_red_pitaya_dac_0_dac_rst [get_bd_pins signal_generator/dac_rst] [get_bd_ports dac_rst_o]
connect_bd_net -net axis_red_pitaya_dac_0_dac_sel [get_bd_pins signal_generator/dac_sel] [get_bd_ports dac_sel_o]
connect_bd_net -net axis_red_pitaya_dac_0_dac_wrt [get_bd_pins signal_generator/dac_wrt] [get_bd_ports dac_wrt_o]
connect_bd_net -net axis_red_pitaya_dac_0_dac_dat [get_bd_pins signal_generator/dac_dat] [get_bd_ports dac_dat_o]
connect_bd_net [get_bd_ports exp_n_tri_io] [get_bd_pins gpio_interface/exp_data_n]
connect_bd_net [get_bd_ports exp_p_tri_io] [get_bd_pins gpio_interface/exp_data_p]
connect_bd_net -net enable_1 [get_bd_pins gpio_interface/enable] [get_bd_pins signal_generator/enable] [get_bd_pins receive_chain/enable]

# ---- address map ----
assign_bd_address -offset 0x40000000 -range 4K -target_address_space [get_bd_addr_spaces processing_system/ps_0/Data] [get_bd_addr_segs receive_chain/config_settings/cfg/s_axi/reg0]
assign_bd_address -offset 0x40001000 -range 4K -target_address_space [get_bd_addr_spaces processing_system/ps_0/Data] [get_bd_addr_segs receive_chain/channel_a/sts_a_channel/s_axi/reg0]
assign_bd_address -offset 0x40002000 -range 4K -target_address_space [get_bd_addr_spaces processing_system/ps_0/Data] [get_bd_addr_segs receive_chain/channel_b/sts_b_channel/s_axi/reg0]
assign_bd_address -offset 0x40003000 -range 4K -target_address_space [get_bd_addr_spaces processing_system/ps_0/Data] [get_bd_addr_segs signal_generator/ref_phase_inc/s_axi/reg0]
assign_bd_address -offset 0x40004000 -range 4K -target_address_space [get_bd_addr_spaces processing_system/ps_0/Data] [get_bd_addr_segs gpio_interface/gpio_register/s_axi/reg0]
assign_bd_address -offset 0x40005000 -range 4K -target_address_space [get_bd_addr_spaces processing_system/ps_0/Data] [get_bd_addr_segs signal_generator/canc_phase_inc/s_axi/reg0]
assign_bd_address -offset 0x40006000 -range 4K -target_address_space [get_bd_addr_spaces processing_system/ps_0/Data] [get_bd_addr_segs signal_generator/canc_phase_offset/s_axi/reg0]
assign_bd_address -offset 0x00000000 -range 512M -target_address_space [get_bd_addr_spaces receive_chain/channel_a/ch_a_writer/M_AXI] [get_bd_addr_segs processing_system/ps_0/S_AXI_HP0/HP0_DDR_LOWOCM]
assign_bd_address -offset 0x00000000 -range 512M -target_address_space [get_bd_addr_spaces receive_chain/channel_b/ch_b_writer/M_AXI] [get_bd_addr_segs processing_system/ps_0/S_AXI_HP1/HP1_DDR_LOWOCM]

validate_bd_design
save_bd_design
